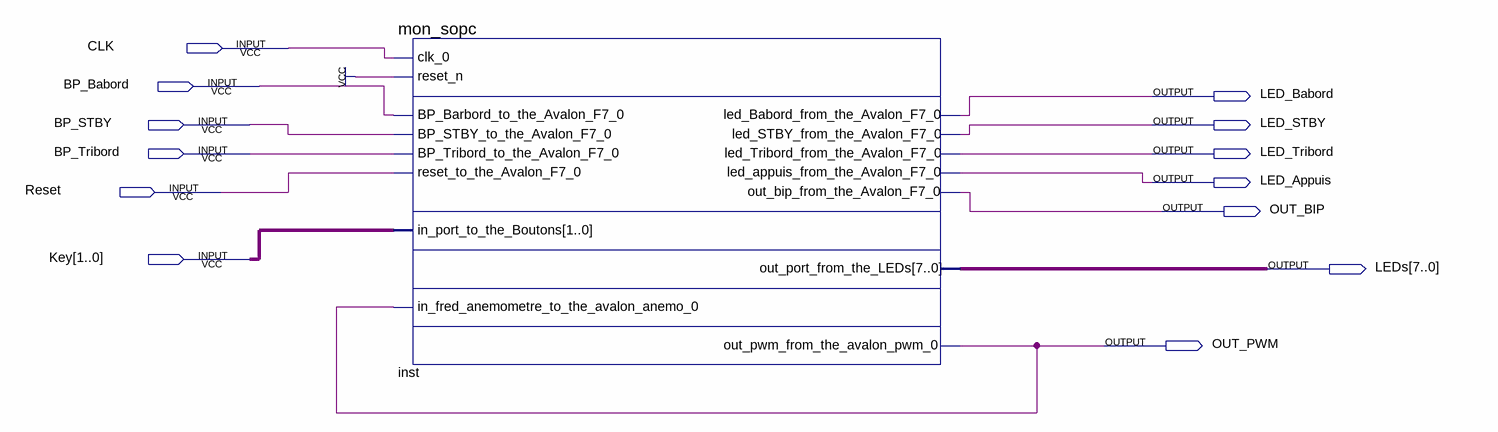
[diagram p0: schematic sheet]
// Quartus schematic sopc_compteur.bdf as structural Verilog: 1 symbols, 13 pins
module sopc_compteur (
  input  CLK,
  input  BP_Babord,
  input  BP_STBY,
  input  BP_Tribord,
  input  Reset,
  input  [1:0] Key,
  output LED_Babord,
  output LED_STBY,
  output LED_Tribord,
  output LED_Appuis,
  output OUT_BIP,
  output [7:0] LEDs,
  output OUT_PWM
);

  mon_sopc inst (
    .clk_0(CLK), .reset_n(1'b1), .BP_Barbord_to_the_Avalon_F7_0(BP_Babord),
    .BP_STBY_to_the_Avalon_F7_0(BP_STBY), .BP_Tribord_to_the_Avalon_F7_0(BP_Tribord),
    .reset_to_the_Avalon_F7_0(Reset), .in_port_to_the_Boutons(Key),
    .in_fred_anemometre_to_the_avalon_anemo_0(OUT_PWM), .led_Babord_from_the_Avalon_F7_0(LED_Babord),
    .led_STBY_from_the_Avalon_F7_0(LED_STBY), .led_Tribord_from_the_Avalon_F7_0(LED_Tribord),
    .led_appuis_from_the_Avalon_F7_0(LED_Appuis), .out_bip_from_the_Avalon_F7_0(OUT_BIP),
    .out_port_from_the_LEDs(LEDs), .out_pwm_from_the_avalon_pwm_0(OUT_PWM));
endmodule
